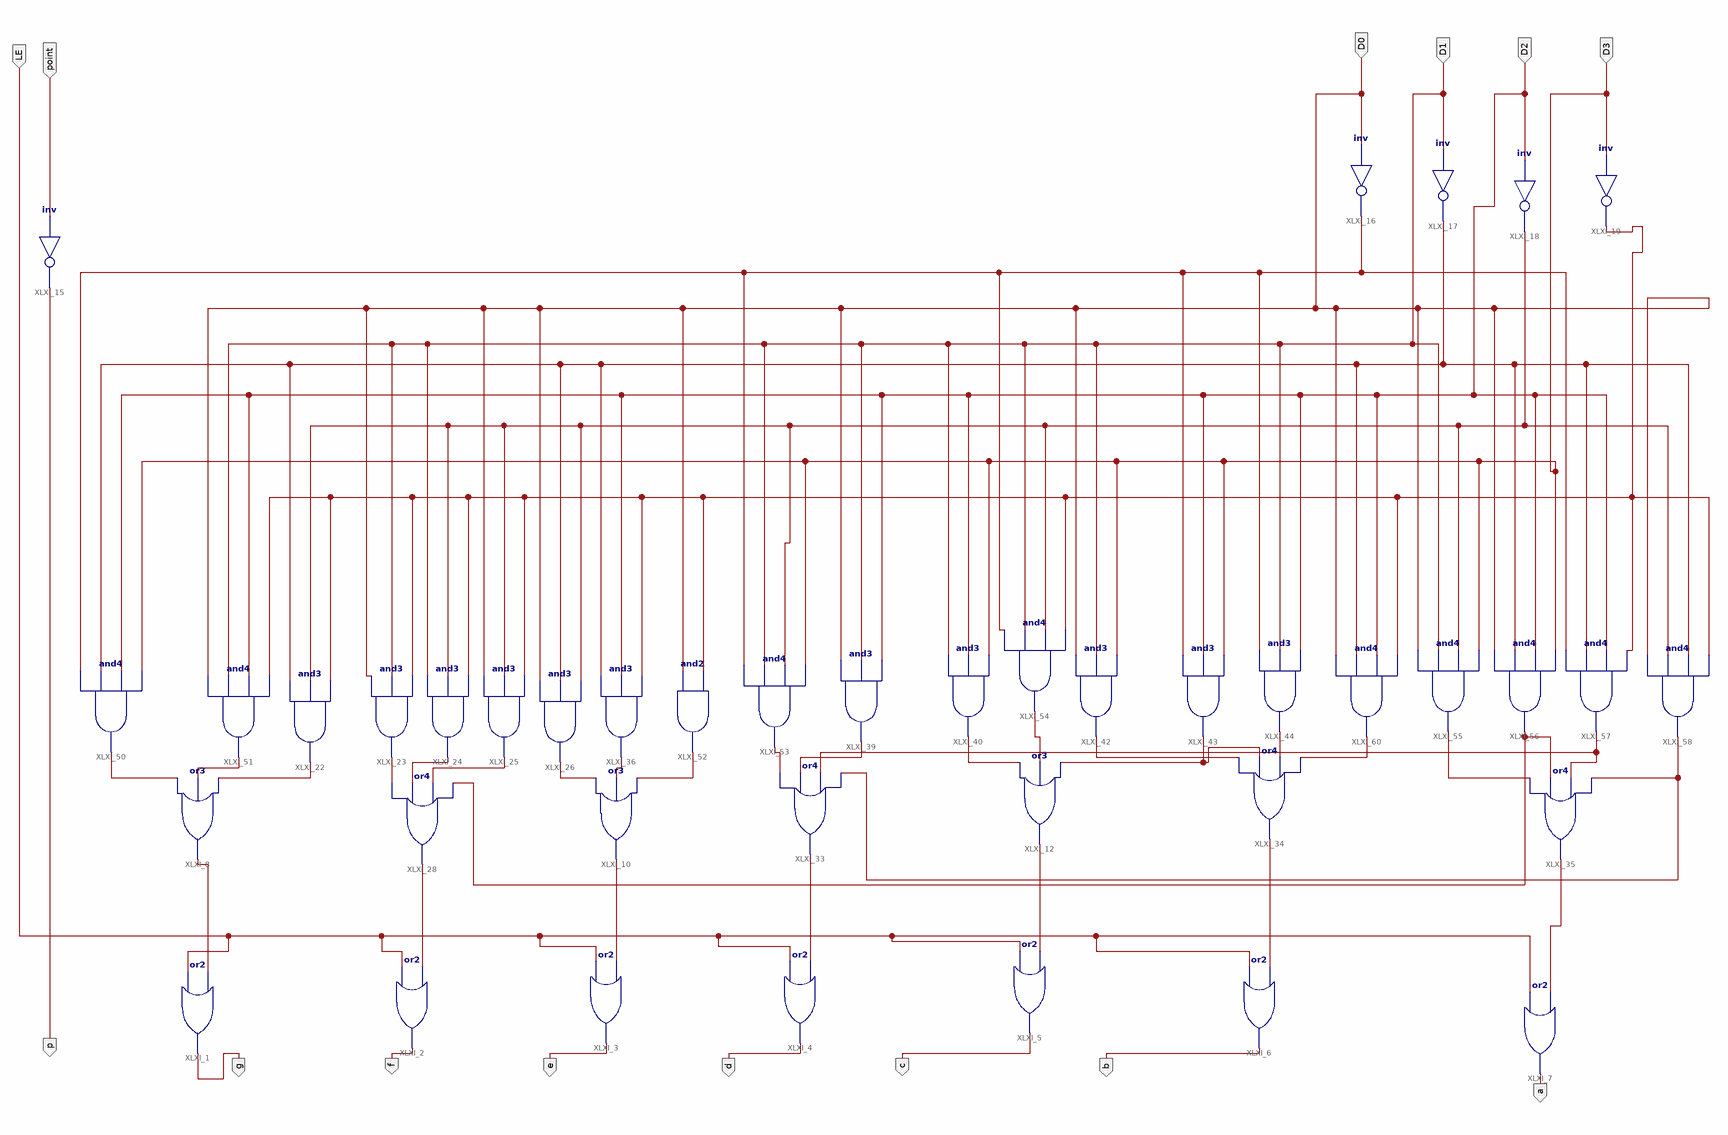
[diagram p0: schematic sheet 1]
// Xilinx ISE schematic MyMC14495.sch (kintex7) as structural Verilog: 40 symbols, 14 ports
module MyMC14495 (
  input  LE,
  input  point,
  input  D0,
  input  D1,
  input  D2,
  input  D3,
  output a,
  output b,
  output c,
  output d,
  output e,
  output f,
  output g,
  output p
);

  wire XLXN_11, XLXN_12, XLXN_13, XLXN_14, XLXN_15, XLXN_16, XLXN_17, XLXN_52, XLXN_53, XLXN_54, XLXN_55,
       XLXN_56, XLXN_57, XLXN_58, XLXN_60, XLXN_61, XLXN_62, XLXN_63, XLXN_65, XLXN_66, XLXN_67, XLXN_69,
       XLXN_70, XLXN_71, XLXN_72, XLXN_73, XLXN_75, XLXN_76, XLXN_77, XLXN_80, XLXN_84, XLXN_88;

  or XLXI_1 (g, LE, XLXN_11);
  or XLXI_2 (f, LE, XLXN_12);
  or XLXI_3 (e, LE, XLXN_13);
  or XLXI_4 (d, LE, XLXN_14);
  or XLXI_5 (c, LE, XLXN_15);
  or XLXI_6 (b, LE, XLXN_16);
  or XLXI_7 (a, LE, XLXN_17);
  or XLXI_8 (XLXN_11, XLXN_53, XLXN_54, XLXN_55);
  or XLXI_10 (XLXN_13, XLXN_61, XLXN_62, XLXN_63);
  or XLXI_12 (XLXN_15, XLXN_70, XLXN_71, XLXN_72);
  not XLXI_15 (p, point);
  not XLXI_16 (XLXN_52, D0);
  not XLXI_17 (XLXN_80, D1);
  not XLXI_18 (XLXN_84, D2);
  not XLXI_19 (XLXN_88, D3);
  and XLXI_22 (XLXN_55, XLXN_80, XLXN_84, XLXN_88);
  and XLXI_23 (XLXN_56, D0, D1, XLXN_88);
  and XLXI_24 (XLXN_57, D1, XLXN_84, XLXN_88);
  and XLXI_25 (XLXN_58, D0, XLXN_84, XLXN_88);
  and XLXI_26 (XLXN_61, D0, XLXN_80, XLXN_84);
  or XLXI_28 (XLXN_12, XLXN_56, XLXN_57, XLXN_58, XLXN_60);
  or XLXI_33 (XLXN_14, XLXN_65, XLXN_66, XLXN_67, XLXN_69);
  or XLXI_34 (XLXN_16, XLXN_73, XLXN_72, XLXN_75, XLXN_76);
  or XLXI_35 (XLXN_17, XLXN_77, XLXN_60, XLXN_67, XLXN_69);
  and XLXI_36 (XLXN_62, XLXN_80, D2, XLXN_88);
  and XLXI_39 (XLXN_66, D0, D1, D2);
  and XLXI_40 (XLXN_70, D1, D2, D3);
  and XLXI_42 (XLXN_73, D0, D1, D3);
  and XLXI_43 (XLXN_72, XLXN_52, D2, D3);
  and XLXI_44 (XLXN_75, XLXN_52, D1, D2);
  and XLXI_50 (XLXN_53, XLXN_52, XLXN_80, D2, D3);
  and XLXI_51 (XLXN_54, D0, D1, D2, XLXN_88);
  and XLXI_52 (XLXN_63, D0, XLXN_88);
  and XLXI_53 (XLXN_65, XLXN_52, D1, XLXN_84, D3);
  and XLXI_54 (XLXN_71, XLXN_52, D1, XLXN_84, XLXN_88);
  and XLXI_55 (XLXN_77, D0, D1, XLXN_84, D3);
  and XLXI_56 (XLXN_60, D0, XLXN_80, D2, D3);
  and XLXI_57 (XLXN_67, XLXN_52, XLXN_80, D2, XLXN_88);
  and XLXI_58 (XLXN_69, D0, XLXN_84, XLXN_80, XLXN_88);
  and XLXI_60 (XLXN_76, D0, XLXN_80, D2, XLXN_88);
endmodule
